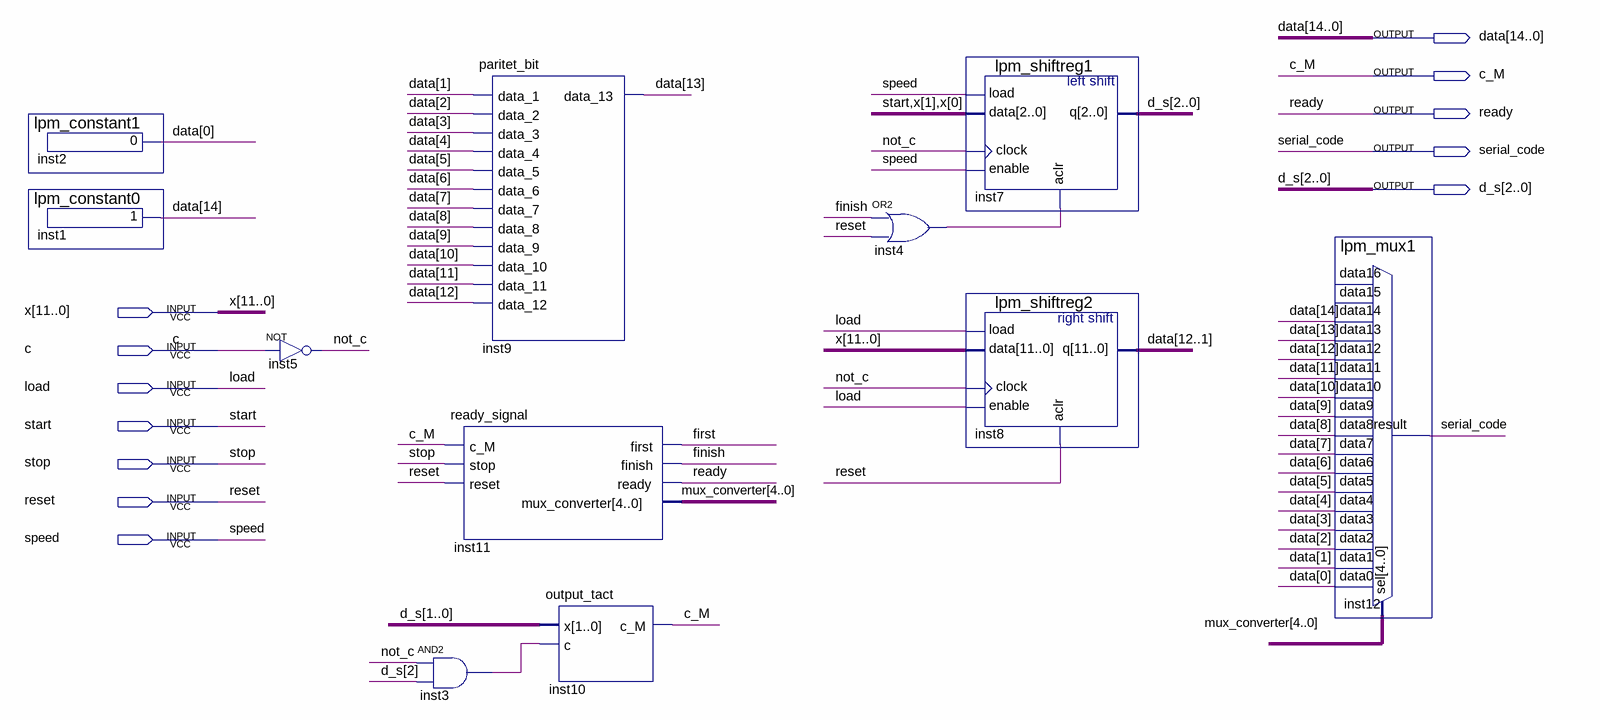
[diagram p0: schematic sheet]
// Quartus schematic mux.bdf as structural Verilog: 11 symbols, 12 pins
module mux (
  input  [11:0] x,
  input  c,
  input  load,
  input  start,
  input  stop,
  input  reset,
  input  speed,
  output [14:0] data,
  output c_M,
  output ready,
  output serial_code,
  output [2:0] d_s
);

  wire finish, first, inst3_out, inst4_out, not_c;
  wire [4:0] mux_converter;

  lpm_constant1 inst2 (.result(data[0]));
  lpm_constant0 inst1 (.result(data[14]));
  not inst5 (not_c, c);
  paritet_bit inst9 (
    .data_1(data[1]), .data_2(data[2]), .data_3(data[3]), .data_4(data[4]), .data_5(data[5]),
    .data_6(data[6]), .data_7(data[7]), .data_8(data[8]), .data_9(data[9]), .data_10(data[10]),
    .data_11(data[11]), .data_12(data[12]), .data_13(data[13]));
  ready_signal inst11 (
    .c_M(c_M), .stop(stop), .reset(reset), .first(first), .finish(finish), .ready(ready),
    .mux_converter(mux_converter));
  and inst3 (inst3_out, not_c, d_s[2]);
  output_tact inst10 (.x(d_s[1:0]), .c(inst3_out), .c_M(c_M));
  or inst4 (inst4_out, finish, reset);
  lpm_shiftreg1 inst7 (.load(speed), .data({start, x[1:0]}), .clock(not_c), .enable(speed), .aclr(inst4_out), .q(d_s));
  lpm_shiftreg2 inst8 (.load(load), .data(x), .clock(not_c), .enable(load), .aclr(reset), .q(data[12:1]));
  lpm_mux1 inst12 (
    .data14(data[14]), .data13(data[13]), .data12(data[12]), .data11(data[11]), .data10(data[10]),
    .data9(data[9]), .data8(data[8]), .data7(data[7]), .data6(data[6]), .data5(data[5]), .data4(data[4]),
    .data3(data[3]), .data2(data[2]), .data1(data[1]), .data0(data[0]), .sel(mux_converter),
    .result(serial_code));  // open: data16, data15
endmodule
